# EAGLE schematic SwitchedATXBreakout (EAGLE 7.2.0)
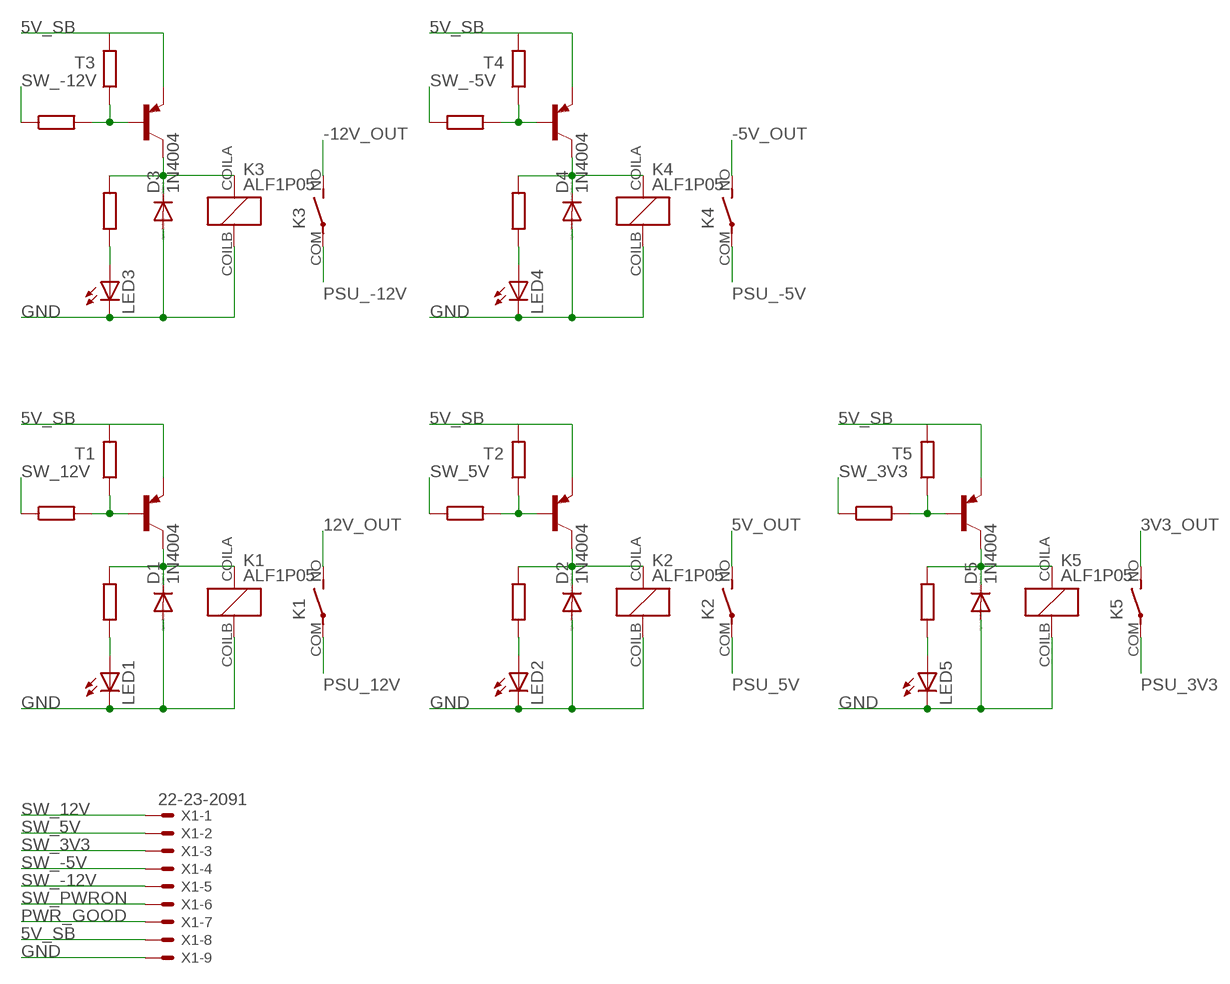
[diagram p0: schematic, sheet 1]

## Parts
D1  1N4004  [DO41-10]
D2  1N4004  [DO41-10]
D3  1N4004  [DO41-10]
D4  1N4004  [DO41-10]
D5  1N4004  [DO41-10]
K1  ALF1P05  [ALF]
K2  ALF1P05  [ALF]
K3  ALF1P05  [ALF]
K4  ALF1P05  [ALF]
K5  ALF1P05  [ALF]
LED1  LED5MM  [LED5MM]
LED2  LED5MM  [LED5MM]
LED3  LED5MM  [LED5MM]
LED4  LED5MM  [LED5MM]
LED5  LED5MM  [LED5MM]
T1  -PNP-TO92  [TO92]
T2  -PNP-TO92  [TO92]
T3  -PNP-TO92  [TO92]
T4  -PNP-TO92  [TO92]
T5  -PNP-TO92  [TO92]
X1  22-23-2091  [22-23-2091]

## Nets
3V3_OUT: K5.NO(1:S)
5V_OUT: K2.NO(1:S)
5V_SB: T1.1(E) T2.1(E) T3.1(E) T4.1(E) T5.1(E) X1.8
12V_OUT: K1.NO(1:S)
-5V_OUT: K4.NO(1:S)
-12V_OUT: K3.NO(1:S)
GND: D1.A D2.A D3.A D4.A D5.A K1.COILB K2.COILB K3.COILB K4.COILB K5.COILB LED1.K(C) LED2.K(C) LED3.K(C) LED4.K(C) LED5.K(C) X1.9
N$1: T1.2(B)
N$2: T2.2(B)
N$3: D1.C K1.COILA T1.3(C)
N$4: D2.C K2.COILA T2.3(C)
N$5: LED1.A
N$6: LED2.A
N$7: T3.2(B)
N$8: D3.C K3.COILA T3.3(C)
N$9: LED3.A
N$10: T4.2(B)
N$11: D4.C K4.COILA T4.3(C)
N$12: LED4.A
N$13: T5.2(B)
N$14: D5.C K5.COILA T5.3(C)
N$15: LED5.A
PSU_3V3: K5.COM(1:P)
PSU_5V: K2.COM(1:P)
PSU_12V: K1.COM(1:P)
PSU_-5V: K4.COM(1:P)
PSU_-12V: K3.COM(1:P)
PWR_GOOD: X1.7
SW_3V3: X1.3
SW_5V: X1.2
SW_12V: X1.1
SW_-5V: X1.4
SW_-12V: X1.5
SW_PWRON: X1.6

## Library data of the parts
D1-D5 = diode:1N4004: DIODE general purpose rectifier, 1 A
K1-K5 = panasonic_alf_relay:ALF1P05: Power relay Source: http://www.mouser.com/ds/2/316/alf-catalog-461593.pdf
LED1-LED5 = led:LED: LED OSRAM: - CHIPLED LG R971, LG N971, LY N971, LG Q971, LY Q971, LO R971, LY R971 LH N974, LH R974 LS Q976, LO Q976, LY Q976 LO Q996 - Hyper CHIPLED LW Q18S LB Q993, LB Q99A, LB R99A - SideLED LS A670, LO A670, LY A670, LG A670, LP A670 LB A673, LV A673, LT A673, LW A673 LH A674 LY A675 LS A676, LA A676, LO A676, LY A676, LW A676 LS A679, LY A679, LG A679 - Hyper Micro SIDELED® LS Y876, LA Y876, LO Y876, LY Y876 LT Y87S - SmartLED LW L88C, LW L88S LB L89C, LB L89S, LG L890 LS L89K, LO L89K, LY L89K LS L896, LA L896, LO L896, LY L896 - TOPLED LS T670, LO T670, LY T670, LG T670, LP T670 LSG T670, LSP T670, LSY T670, LOP T670, LYG T670 LG T671, LOG T671, LSG T671 LB T673, LV T673, LT T673, LW T673 LH T674 LS T676, LA T676, LO T676, LY T676, LB T676, LH T676, LSB T676, LW T676 LB T67C, LV T67C, LT T67C, LS T67K, LO T67K, LY T67K, LW E67C LS E67B, LA E67B, LO E67B, LY E67B, LB E67C, LV E67C, LT E67C LW T67C LS T679, LY T679, LG T679 LS T770, LO T770, LY T770, LG T770, LP T770 LB T773, LV T773, LT T773, LW T773 LH T774 LS E675, LA E675, LY E675, LS T675 LS T776, LA T776, LO T776, LY T776, LB T776 LHGB T686 LT T68C, LB T68C - Hyper Mini TOPLED® LB M676 - Mini TOPLED Santana® LG M470 LS M47K, LO M47K, LY M47K Source: http://www.osram.convergy.de LUXEON: - LUMILED® LXK2-PW12-R00, LXK2-PW12-S00, LXK2-PW14-U00, LXK2-PW14-V00 LXK2-PM12-R00, LXK2-PM12-S00, LXK2-PM14-U00 LXK2-PE12-Q00, LXK2-PE12-R00, LXK2-PE12-S00, LXK2-PE14-T00, LXK2-PE14-U00 LXK2-PB12-K00, LXK2-PB12-L00, LXK2-PB12-M00, LXK2-PB14-N00, LXK2-PB14-P00, LXK2-PB14-Q00 LXK2-PR12-L00, LXK2-PR12-M00, LXK2-PR14-Q00, LXK2-PR14-R00 LXK2-PD12-Q00, LXK2-PD12-R00, LXK2-PD12-S00 LXK2-PH12-R00, LXK2-PH12-S00 LXK2-PL12-P00, LXK2-PL12-Q00, LXK2-PL12-R00 Source: www.luxeon.com KINGBRIGHT: KA-3528ASYC Source: www.kingbright.com
T1-T5 = transistor:*-PNP-: PNP Transistror
X1 = con-molex:22-23-2091: .100" (2.54mm) Center Header - 9 Pin; MF: MOLEX; MPN: 22-23-2091; OC_FARNELL: 1756827; OC_NEWARK: 56H0450